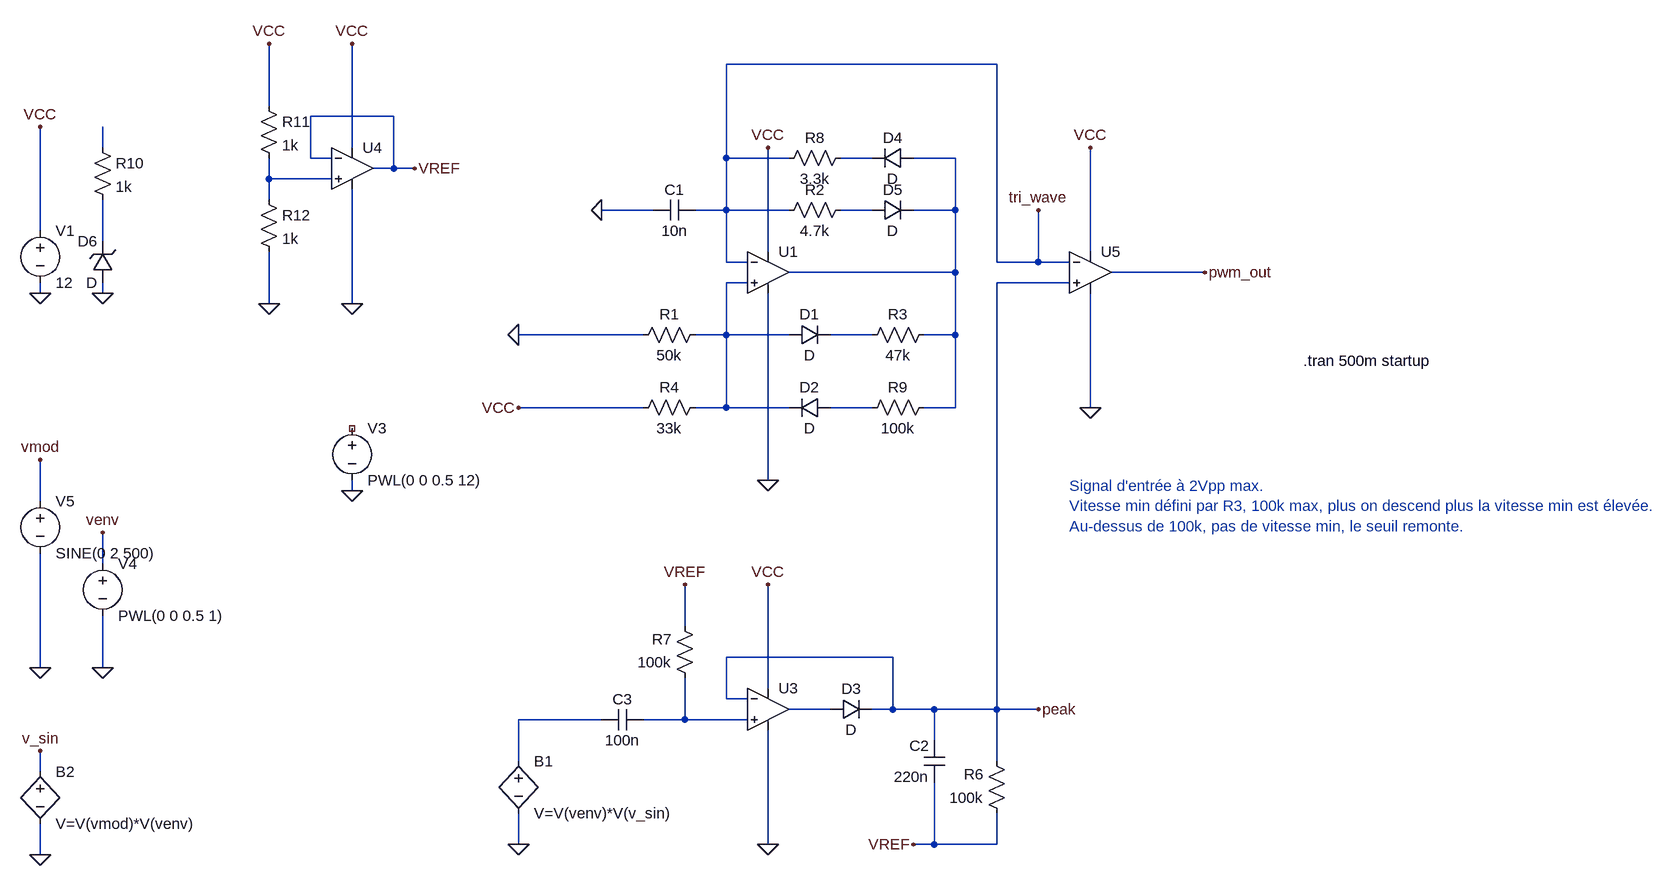
[diagram p0: schematic peak_osc_mli_02.asc]
peak_osc_mli_02.asc, the LTspice schematic file:
Version 4
SHEET 1 2396 1228
WIRE 576 -144 160 -144
WIRE -544 -80 -544 -176
WIRE -352 -64 -480 -64
WIRE -800 -16 -800 -48
WIRE -416 -16 -416 -176
WIRE -480 0 -480 -64
WIRE -448 0 -480 0
WIRE 160 0 160 -144
WIRE 256 0 160 0
WIRE 384 0 336 0
WIRE 512 0 448 0
WIRE -352 16 -352 -64
WIRE -352 16 -384 16
WIRE -320 16 -352 16
WIRE -544 32 -544 0
WIRE -448 32 -544 32
WIRE -544 64 -544 32
WIRE 48 80 -32 80
WIRE 160 80 160 0
WIRE 160 80 112 80
WIRE 256 80 160 80
WIRE 384 80 336 80
WIRE 512 80 512 0
WIRE 512 80 448 80
WIRE -896 112 -896 -48
WIRE -800 128 -800 64
WIRE 224 144 224 -16
WIRE 720 144 720 -16
WIRE 160 160 160 80
WIRE 192 160 160 160
WIRE 576 160 576 -144
WIRE 640 160 640 80
WIRE 640 160 576 160
WIRE 688 160 640 160
WIRE 512 176 512 80
WIRE 512 176 256 176
WIRE 896 176 752 176
WIRE 192 192 160 192
WIRE 688 192 576 192
WIRE -896 208 -896 192
WIRE -800 208 -800 192
WIRE -544 224 -544 144
WIRE -416 224 -416 48
WIRE 32 272 -160 272
WIRE 160 272 160 192
WIRE 160 272 112 272
WIRE 256 272 160 272
WIRE 384 272 320 272
WIRE 512 272 512 176
WIRE 512 272 464 272
WIRE 32 384 -160 384
WIRE 160 384 160 272
WIRE 160 384 112 384
WIRE 256 384 160 384
WIRE 384 384 320 384
WIRE 512 384 512 272
WIRE 512 384 464 384
WIRE 720 384 720 208
WIRE 224 496 224 208
WIRE -416 512 -416 496
WIRE -896 528 -896 464
WIRE -800 624 -800 576
WIRE 96 720 96 656
WIRE 416 768 160 768
WIRE -896 784 -896 608
WIRE -800 784 -800 704
WIRE 224 816 224 656
WIRE 160 832 160 768
WIRE 192 832 160 832
WIRE 320 848 256 848
WIRE 416 848 416 768
WIRE 416 848 384 848
WIRE 480 848 416 848
WIRE 576 848 576 192
WIRE 576 848 480 848
WIRE 640 848 576 848
WIRE -32 864 -160 864
WIRE 96 864 96 800
WIRE 96 864 32 864
WIRE 192 864 96 864
WIRE 480 896 480 848
WIRE -160 928 -160 864
WIRE 576 928 576 848
WIRE -896 944 -896 912
WIRE -160 1056 -160 1008
WIRE 224 1056 224 880
WIRE 480 1056 480 960
WIRE 480 1056 448 1056
WIRE 576 1056 576 1008
WIRE 576 1056 480 1056
WIRE -896 1072 -896 1024
FLAG -896 208 0
FLAG 224 496 0
FLAG 224 -16 VCC
FLAG -800 208 0
FLAG -320 16 VREF
FLAG -32 80 0
FLAG 720 384 0
FLAG 720 -16 VCC
FLAG -416 512 0
FLAG 224 1056 0
FLAG 224 656 VCC
FLAG 96 656 VREF
FLAG -160 1056 0
FLAG -896 784 0
FLAG -800 784 0
FLAG -896 1072 0
FLAG -896 464 vmod
FLAG -800 576 venv
FLAG -896 912 v_sin
FLAG -160 384 VCC
FLAG -160 272 0
FLAG 448 1056 VREF
FLAG -896 -48 VCC
FLAG -416 224 0
FLAG -416 -176 VCC
FLAG -544 224 0
FLAG -544 -176 VCC
FLAG 896 176 pwm_out
FLAG 640 80 tri_wave
FLAG 640 848 peak
SYMBOL res 128 256 R90
WINDOW 0 0 56 VBottom 2
WINDOW 3 32 56 VTop 2
SYMATTR InstName R1
SYMATTR Value 50k
SYMBOL cap 112 64 R90
WINDOW 0 0 32 VBottom 2
WINDOW 3 32 32 VTop 2
SYMATTR InstName C1
SYMATTR Value 10n
SYMBOL res 352 64 R90
WINDOW 0 0 56 VBottom 2
WINDOW 3 32 56 VTop 2
SYMATTR InstName R2
SYMATTR Value 4.7k
SYMBOL voltage -896 96 R0
SYMATTR InstName V1
SYMATTR Value 12
SYMBOL res 128 368 R90
WINDOW 0 0 56 VBottom 2
WINDOW 3 32 56 VTop 2
SYMATTR InstName R4
SYMATTR Value 33k
SYMBOL voltage -416 400 R0
WINDOW 123 0 0 Left 2
WINDOW 39 0 0 Left 2
SYMATTR InstName V3
SYMATTR Value PWL(0 0 0.5 12)
SYMBOL Opamps\\UniversalOpamp2 224 848 R0
SYMATTR InstName U3
SYMBOL diode 320 864 R270
WINDOW 0 32 32 VTop 2
WINDOW 3 0 32 VBottom 2
SYMATTR InstName D3
SYMBOL cap 496 960 R180
WINDOW 0 24 56 Left 2
WINDOW 3 24 8 Left 2
SYMATTR InstName C2
SYMATTR Value 220n
SYMBOL cap -32 880 R270
WINDOW 0 32 32 VTop 2
WINDOW 3 0 32 VBottom 2
SYMATTR InstName C3
SYMATTR Value 100n
SYMBOL res 112 816 R180
WINDOW 0 36 76 Left 2
WINDOW 3 36 40 Left 2
SYMATTR InstName R7
SYMATTR Value 100k
SYMBOL bv -160 912 R0
SYMATTR InstName B1
SYMATTR Value V=V(venv)*V(v_sin)
SYMBOL voltage -800 608 R0
WINDOW 123 0 0 Left 2
WINDOW 39 0 0 Left 2
SYMATTR InstName V4
SYMATTR Value PWL(0 0 0.5 1)
SYMBOL voltage -896 512 R0
WINDOW 123 24 44 Left 2
WINDOW 39 0 0 Left 2
SYMATTR InstName V5
SYMATTR Value SINE(0 2 500)
SYMBOL bv -896 928 R0
SYMATTR InstName B2
SYMATTR Value V=V(vmod)*V(venv)
SYMBOL res 352 -16 R90
WINDOW 0 0 56 VBottom 2
WINDOW 3 32 56 VTop 2
SYMATTR InstName R8
SYMATTR Value 3.3k
SYMBOL diode 448 -16 R90
WINDOW 0 0 32 VBottom 2
WINDOW 3 32 32 VTop 2
SYMATTR InstName D4
SYMBOL diode 384 96 R270
WINDOW 0 32 32 VTop 2
WINDOW 3 0 32 VBottom 2
SYMATTR InstName D5
SYMBOL res 480 368 R90
WINDOW 0 0 56 VBottom 2
WINDOW 3 32 56 VTop 2
SYMATTR InstName R9
SYMATTR Value 100k
SYMBOL res 592 1024 R180
WINDOW 0 36 76 Left 2
WINDOW 3 36 40 Left 2
SYMATTR InstName R6
SYMATTR Value 100k
SYMBOL res 480 256 R90
WINDOW 0 0 56 VBottom 2
WINDOW 3 32 56 VTop 2
SYMATTR InstName R3
SYMATTR Value 47k
SYMBOL diode 256 288 R270
WINDOW 0 32 32 VTop 2
WINDOW 3 0 32 VBottom 2
SYMATTR InstName D1
SYMBOL diode 320 368 R90
WINDOW 0 0 32 VBottom 2
WINDOW 3 32 32 VTop 2
SYMATTR InstName D2
SYMBOL zener -784 192 R180
WINDOW 0 24 64 Left 2
WINDOW 3 24 0 Left 2
SYMATTR InstName D6
SYMBOL res -816 -32 R0
SYMATTR InstName R10
SYMATTR Value 1k
SYMBOL Opamps\\UniversalOpamp2 -416 16 R0
SYMATTR InstName U4
SYMBOL res -560 -96 R0
SYMATTR InstName R11
SYMATTR Value 1k
SYMBOL res -560 48 R0
SYMATTR InstName R12
SYMATTR Value 1k
SYMBOL Opamps\\UniversalOpamp2 224 176 R0
SYMATTR InstName U1
SYMBOL Opamps\\UniversalOpamp2 720 176 R0
SYMATTR InstName U5
TEXT 1048 312 Left 2 !.tran 500m startup
TEXT 688 504 Left 2 ;Signal d'entrée à 2Vpp max.\nVitesse min défini par R3, 100k max, plus on descend plus la vitesse min est élevée.\nAu-dessus de 100k, pas de vitesse min, le seuil remonte.

The netlist it stands for:
* peak_osc_mli_02.asc
R1 N007 0 50k
C1 tri_wave 0 10n
R2 N005 tri_wave 4.7k
V1 VCC 0 12
R4 N007 VCC 33k
V3 NC_01 0 PWL(0 0 0.5 12)
XU3 N012 peak VCC 0 N010 level.2 Avol=1Meg GBW=10Meg Slew=10Meg ilimit=25m rail=0 Vos=0 phimargin=45 en=0 enk=0 in=0 ink=0 Rin=500Meg  ; pins IN+ IN- V+ V- OUT
D3 N010 peak D
C2 VREF peak 220n
C3 N011 N012 100n
R7 N012 VREF 100k
B1 N011 0 V=V(venv)*V(v_sin)
V4 venv 0 PWL(0 0 0.5 1)
V5 vmod 0 SINE(0 2 500)
B2 v_sin 0 V=V(vmod)*V(venv)
R8 N002 tri_wave 3.3k
D4 N003 N002 D
D5 N005 N003 D
R9 N003 N009 100k
R6 VREF peak 100k
R3 N003 N008 47k
D1 N007 N008 D
D2 N009 N007 D
D6 0 N006 D
R10 N001 N006 1k
XU4 N004 VREF VCC 0 VREF level.2 Avol=1Meg GBW=10Meg Slew=10Meg ilimit=25m rail=0 Vos=0 phimargin=45 en=0 enk=0 in=0 ink=0 Rin=500Meg  ; pins IN+ IN- V+ V- OUT
R11 VCC N004 1k
R12 N004 0 1k
XU1 N007 tri_wave VCC 0 N003 level.2 Avol=1Meg GBW=10Meg Slew=10Meg ilimit=25m rail=0 Vos=0 phimargin=45 en=0 enk=0 in=0 ink=0 Rin=500Meg  ; pins IN+ IN- V+ V- OUT
XU5 peak tri_wave VCC 0 pwm_out level.2 Avol=1Meg GBW=10Meg Slew=10Meg ilimit=25m rail=0 Vos=0 phimargin=45 en=0 enk=0 in=0 ink=0 Rin=500Meg  ; pins IN+ IN- V+ V- OUT
.model D D
.lib standard.dio
.tran 500m startup
* Signal d'entrée à 2Vpp max.
* Vitesse min défini par R3, 100k max, plus on descend plus la vitesse min est élevée.
* Au-dessus de 100k, pas de vitesse min, le seuil remonte.
.lib UniversalOpamps2.sub
.backanno
.end